# EAGLE design HRT PDB 17-18 schem (EAGLE 8.5.0)
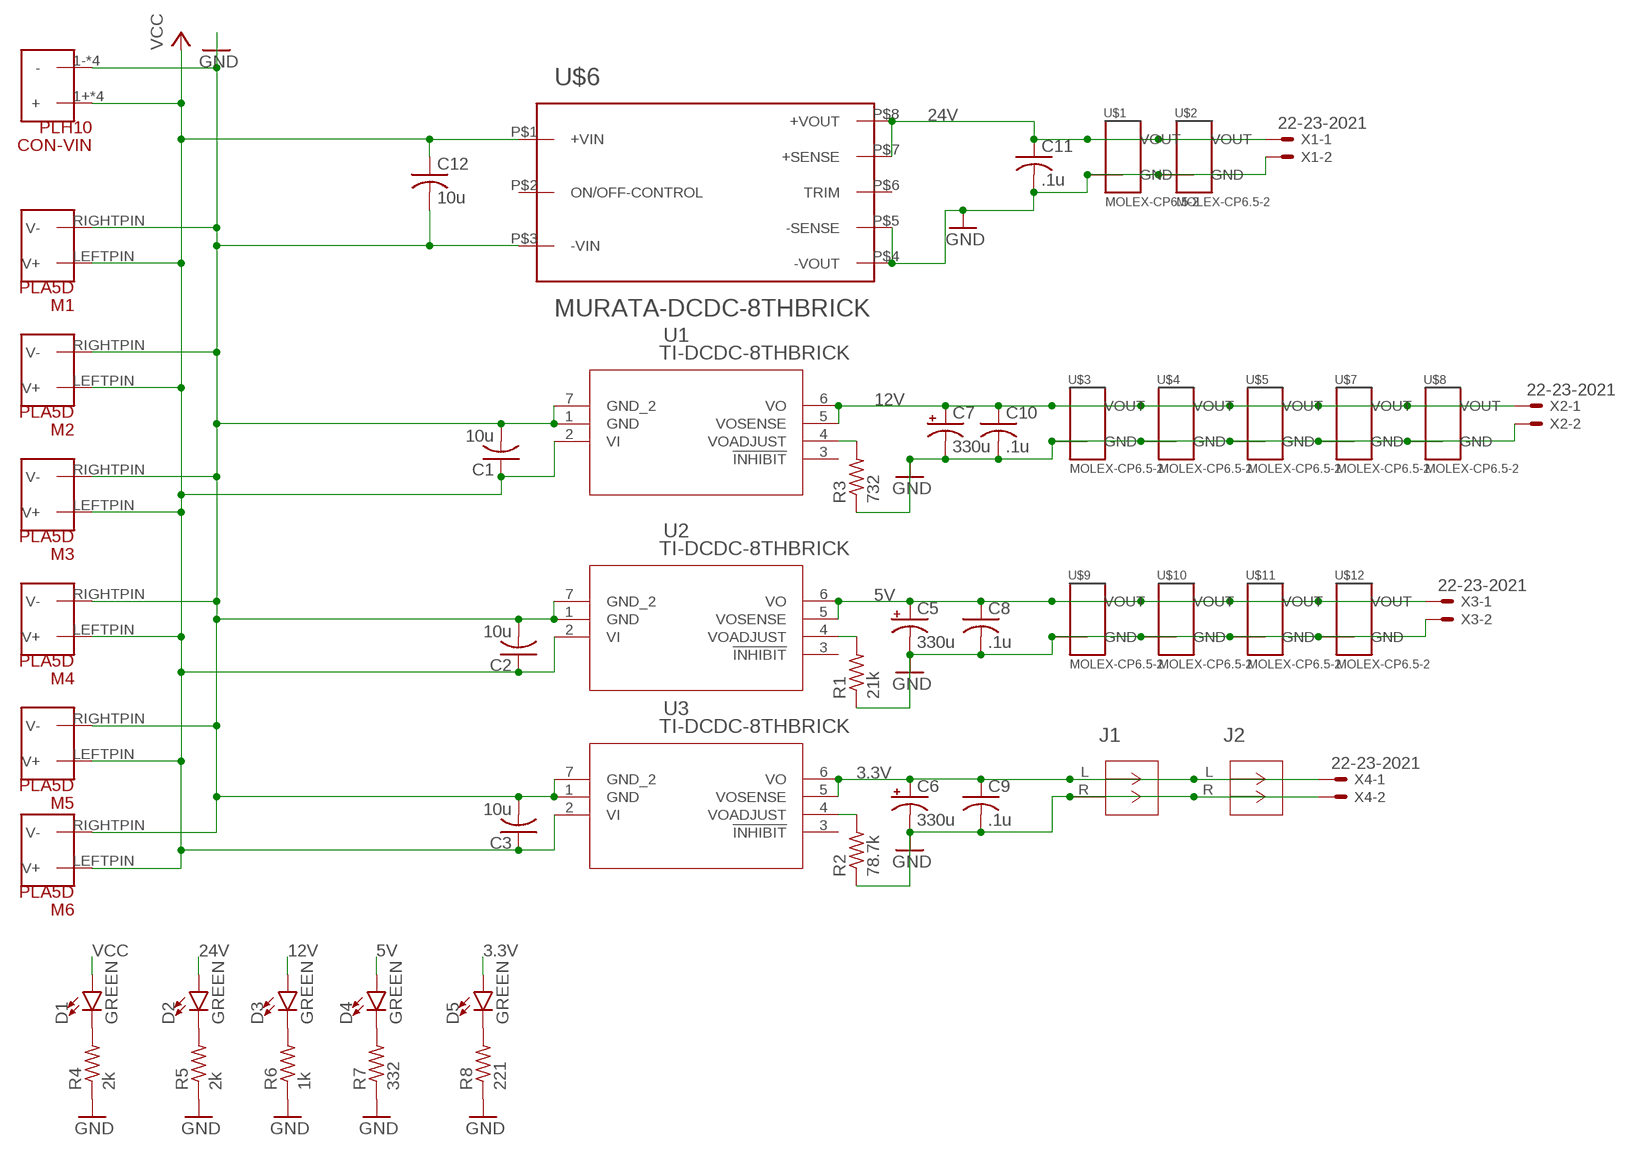
[diagram p0: schematic, sheet 1]

## Parts
C1  10u  C-USC1210  [C1210]
C2  10u  C-USC1210  [C1210]
C3  10u  C-USC1210  [C1210]
C5  330u  CPOL-USE5-10.5  [E5-10,5]
C6  330u  CPOL-USE5-10.5  [E5-10,5]
C7  330u  CPOL-USE5-10.5  [E5-10,5]
C8  .1u  C-USC0603  [C0603]
C9  .1u  C-USC0603  [C0603]
C10  .1u  C-USC0603  [C0603]
C11  .1u  C-USC0603  [C0603]
C12  10u  C-USC1210  [C1210]
CON-VIN  PLH10  [PLH10PCKG]
D1  GREEN  LED-GREEN0603  [LED-0603]
D2  GREEN  LED-GREEN0603  [LED-0603]
D3  GREEN  LED-GREEN0603  [LED-0603]
D4  GREEN  LED-GREEN0603  [LED-0603]
D5  GREEN  LED-GREEN0603  [LED-0603]
J1  TE-TERM-BLOCK  [TE-TERM-BLOCK]
J2  TE-TERM-BLOCK  [TE-TERM-BLOCK]
M1  PLA5D  [PLA5PACK]
M2  PLA5D  [PLA5PACK]
M3  PLA5D  [PLA5PACK]
M4  PLA5D  [PLA5PACK]
M5  PLA5D  [PLA5PACK]
M6  PLA5D  [PLA5PACK]
R1  21k  R-US_R0603  [R0603]
R2  78.7k  R-US_R0603  [R0603]
R3  732  R-US_R0603  [R0603]
R4  2k  R-US_R0805  [R0805]
R5  2k  R-US_R0805  [R0805]
R6  1k  R-US_R0805  [R0805]
R7  332  R-US_R0805  [R0805]
R8  221  R-US_R0805  [R0805]
U1  TI-DCDC-8THBRICK  [TIBRICK]
U2  TI-DCDC-8THBRICK  [TIBRICK]
U3  TI-DCDC-8THBRICK  [TIBRICK]
U$1  MOLEX-CP6.5-2  [151048-X2XX]
U$2  MOLEX-CP6.5-2  [151048-X2XX]
U$3  MOLEX-CP6.5-2  [151048-X2XX]
U$4  MOLEX-CP6.5-2  [151048-X2XX]
U$5  MOLEX-CP6.5-2  [151048-X2XX]
U$6  MURATA-DCDC-8THBRICK  [MURATA-8THBRICK]
U$7  MOLEX-CP6.5-2  [151048-X2XX]
U$8  MOLEX-CP6.5-2  [151048-X2XX]
U$9  MOLEX-CP6.5-2  [151048-X2XX]
U$10  MOLEX-CP6.5-2  [151048-X2XX]
U$11  MOLEX-CP6.5-2  [151048-X2XX]
U$12  MOLEX-CP6.5-2  [151048-X2XX]
X1  22-23-2021  [22-23-2021]
X2  22-23-2021  [22-23-2021]
X3  22-23-2021  [22-23-2021]
X4  22-23-2021  [22-23-2021]

## Nets
3.3V: C6.+ C9.1 D5.A J1.L J2.L U3.5(VOSENSE) U3.6(VO) X4.1
5V: C5.+ C8.1 D4.A U2.5(VOSENSE) U2.6(VO) U$9.VOUT U$10.VOUT U$11.VOUT U$12.VOUT X3.1
12V: C7.+ C10.1 D3.A U1.5(VOSENSE) U1.6(VO) U$3.VOUT U$4.VOUT U$5.VOUT U$7.VOUT U$8.VOUT X2.1
24V: C11.1 D2.A U$1.VOUT U$2.VOUT U$6.P$7(+SENSE) U$6.P$8(+VOUT) X1.1
GND: C1.2 C2.2 C3.2 C5.- C6.- C7.- C8.2 C9.2 C10.2 C11.2 C12.2 CON-VIN.1-(-) CON-VIN.2-(-) CON-VIN.3-(-) CON-VIN.4-(-) J1.R J2.R M1.RIGHTPIN(V-) M2.RIGHTPIN(V-) M3.RIGHTPIN(V-) M4.RIGHTPIN(V-) M5.RIGHTPIN(V-) M6.RIGHTPIN(V-) R1.1 R2.1 R3.1 R4.1 R5.1 R6.1 R7.1 R8.1 U1.1(GND) U1.7(GND_2) U2.1(GND) U2.7(GND_2) U3.1(GND) U3.7(GND_2) U$1.GND U$2.GND U$3.GND U$4.GND U$5.GND U$6.P$3(-VIN) U$6.P$4(-VOUT) U$6.P$5(-SENSE) U$7.GND U$8.GND U$9.GND U$10.GND U$11.GND U$12.GND X1.2 X2.2 X3.2 X4.2
N$2: D1.C R4.2
N$3: D2.C R5.2
N$4: R2.2 U3.4(VOADJUST)
N$5: R3.2 U1.4(VOADJUST)
N$6: R1.2 U2.4(VOADJUST)
N$7: D3.C R6.2
N$8: D4.C R7.2
N$9: D5.C R8.2
VCC: C1.1 C2.1 C3.1 C12.1 CON-VIN.1+(+) CON-VIN.2+(+) CON-VIN.3+(+) CON-VIN.4+(+) D1.A M1.LEFTPIN(V+) M2.LEFTPIN(V+) M3.LEFTPIN(V+) M4.LEFTPIN(V+) M5.LEFTPIN(V+) M6.LEFTPIN(V+) U1.2(VI) U2.2(VI) U3.2(VI) U$6.P$1(+VIN)
Unconnected: U1.3(!INHIBIT) U2.3(!INHIBIT) U3.3(!INHIBIT) U$6.P$2(ON/OFF-CONTROL) U$6.P$6(TRIM)

## Library data of the parts
C1-C3 C8-C12 = rcl:C-US: CAPACITOR, American symbol; SPICEPREFIX: C
C5-C7 = rcl:CPOL-US: POLARIZED CAPACITOR, American symbol; SPICEPREFIX: C
CON-VIN = HuskyRobotics17-18:PLH10: Phoenix PLH 5/ 2-7,5-ZF - 1792106 10mm spaced 51A latch terminal block 2 pos
D1-D5 = SparkFun-LED:LED-GREEN: Green SMD LED Used in manufacturing of various products at SparkFun Packages: 0603 - SMD 0603 package [Product Link] <http://www.futureelectronics.com/en/technologies/semiconductors/optoelectronics/leds/Pages/9894312-LTST-C190GKT.aspx?CrossPart=HSMG-C190&IM=0> LilyPad 1206 - SMD1206 LilyPad package [Product Link] <http://www.futureelectronics.com/en/Technologies/Product.aspx?ProductID=IN150NGHARVATEKCORPORATION2049943&IM=0> 1206 - SMD1206 package [Product Link] <http://www.futureelectronics.com/en/technologies/semiconductors/optoelectronics/leds/Pages/8315665-LTST-C150KGKT.aspx?IM=0> 1206 Bottom Mount -SMD 1206 Bottom Mount [Product Link] <http://www.digikey.com/product-detail/en/lite-on-inc/LTST-C230KGKT/160-1456-1-ND/386854> SparkFun Products: Pro Mini 328 -5V <https://www.sparkfun.com/products/821> RedBoard <https://www.sparkfun.com/products/12757> MP3 Trigger <https://www.sparkfun.com/products/13720> Makey Makey <https://www.sparkfun.com/products/11076>; PROD_ID: DIO-00821
J1 J2 = HuskyRobotics17-18:TE-TERM-BLOCK; MANUFACTURER_PART_NUMBER: 2828342; VENDOR: Tyco Electronics
M1-M6 = HuskyRobotics17-18:PLA5D
R1-R8 = rcl:R-US_: RESISTOR, American symbol; SPICEPREFIX: R
U1-U3 = HuskyRobotics17-18:TI-DCDC-8THBRICK; MANUFACTURER_PART_NUMBER: PTN78020WAH; VENDOR: Texas Instruments
U$1-U$5 U$7-U$12 = HuskyRobotics17-18:MOLEX-CP6.5-2: 151048 Molex CP-6.5 connector. 2 circuits, thru hole. For HRC power conversion board. http://www.molex.com/molex/products/datasheet.jsp?part=active/1510481200_PCB_HEADERS.xml#documentsAnchor Alex Hoffman
U$6 = HuskyRobotics17-18:MURATA-DCDC-8THBRICK: Isolated Module DC DC Converter 1 Output 12V 6A 9V - 36V Input 811-2225-5-ND
X1-X4 = con-molex:22-23-2021: .100" (2.54mm) Center Header - 2 Pin; MF: MOLEX; MPN: 22-23-2021; OC_FARNELL: 1462926; OC_NEWARK: 25C3832

## Board
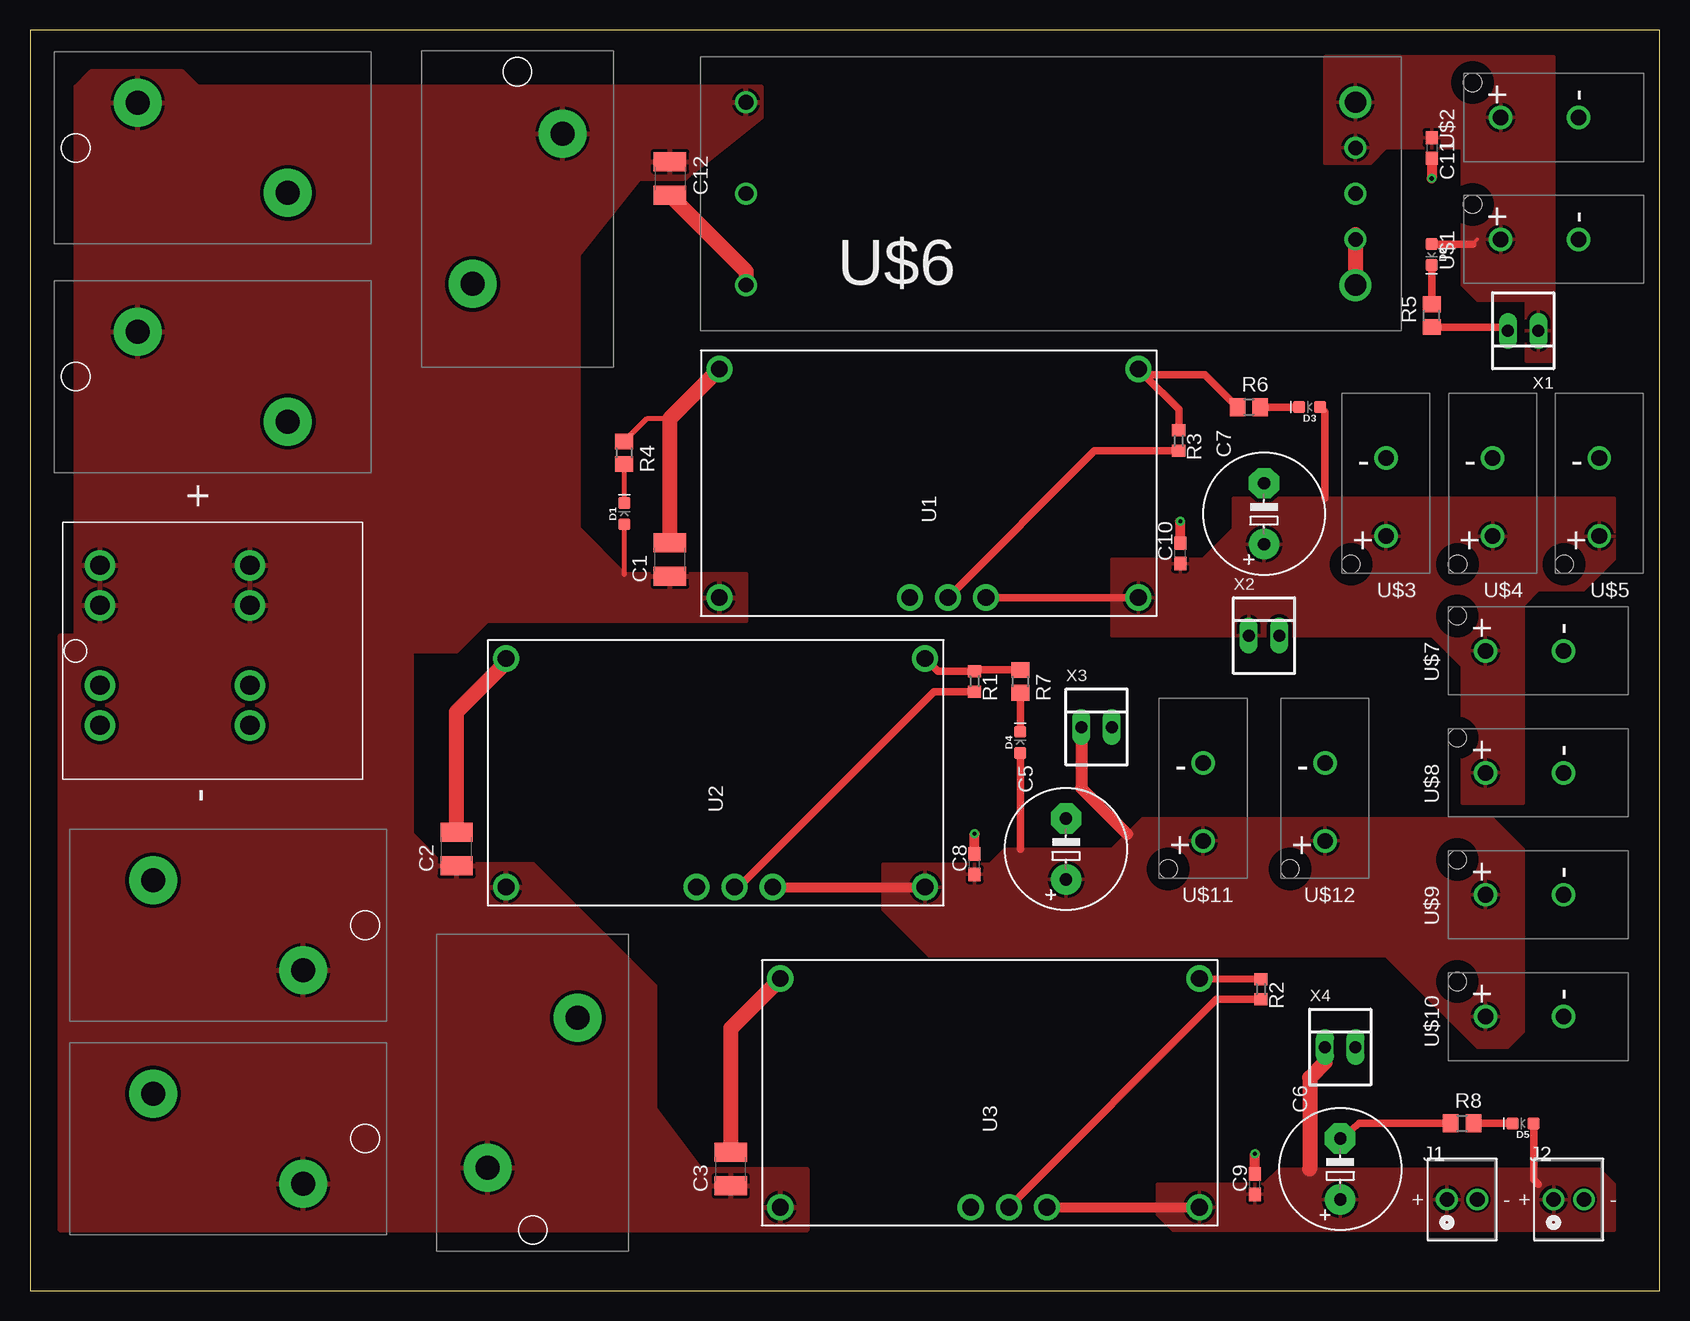
[diagram p1: board, top side]
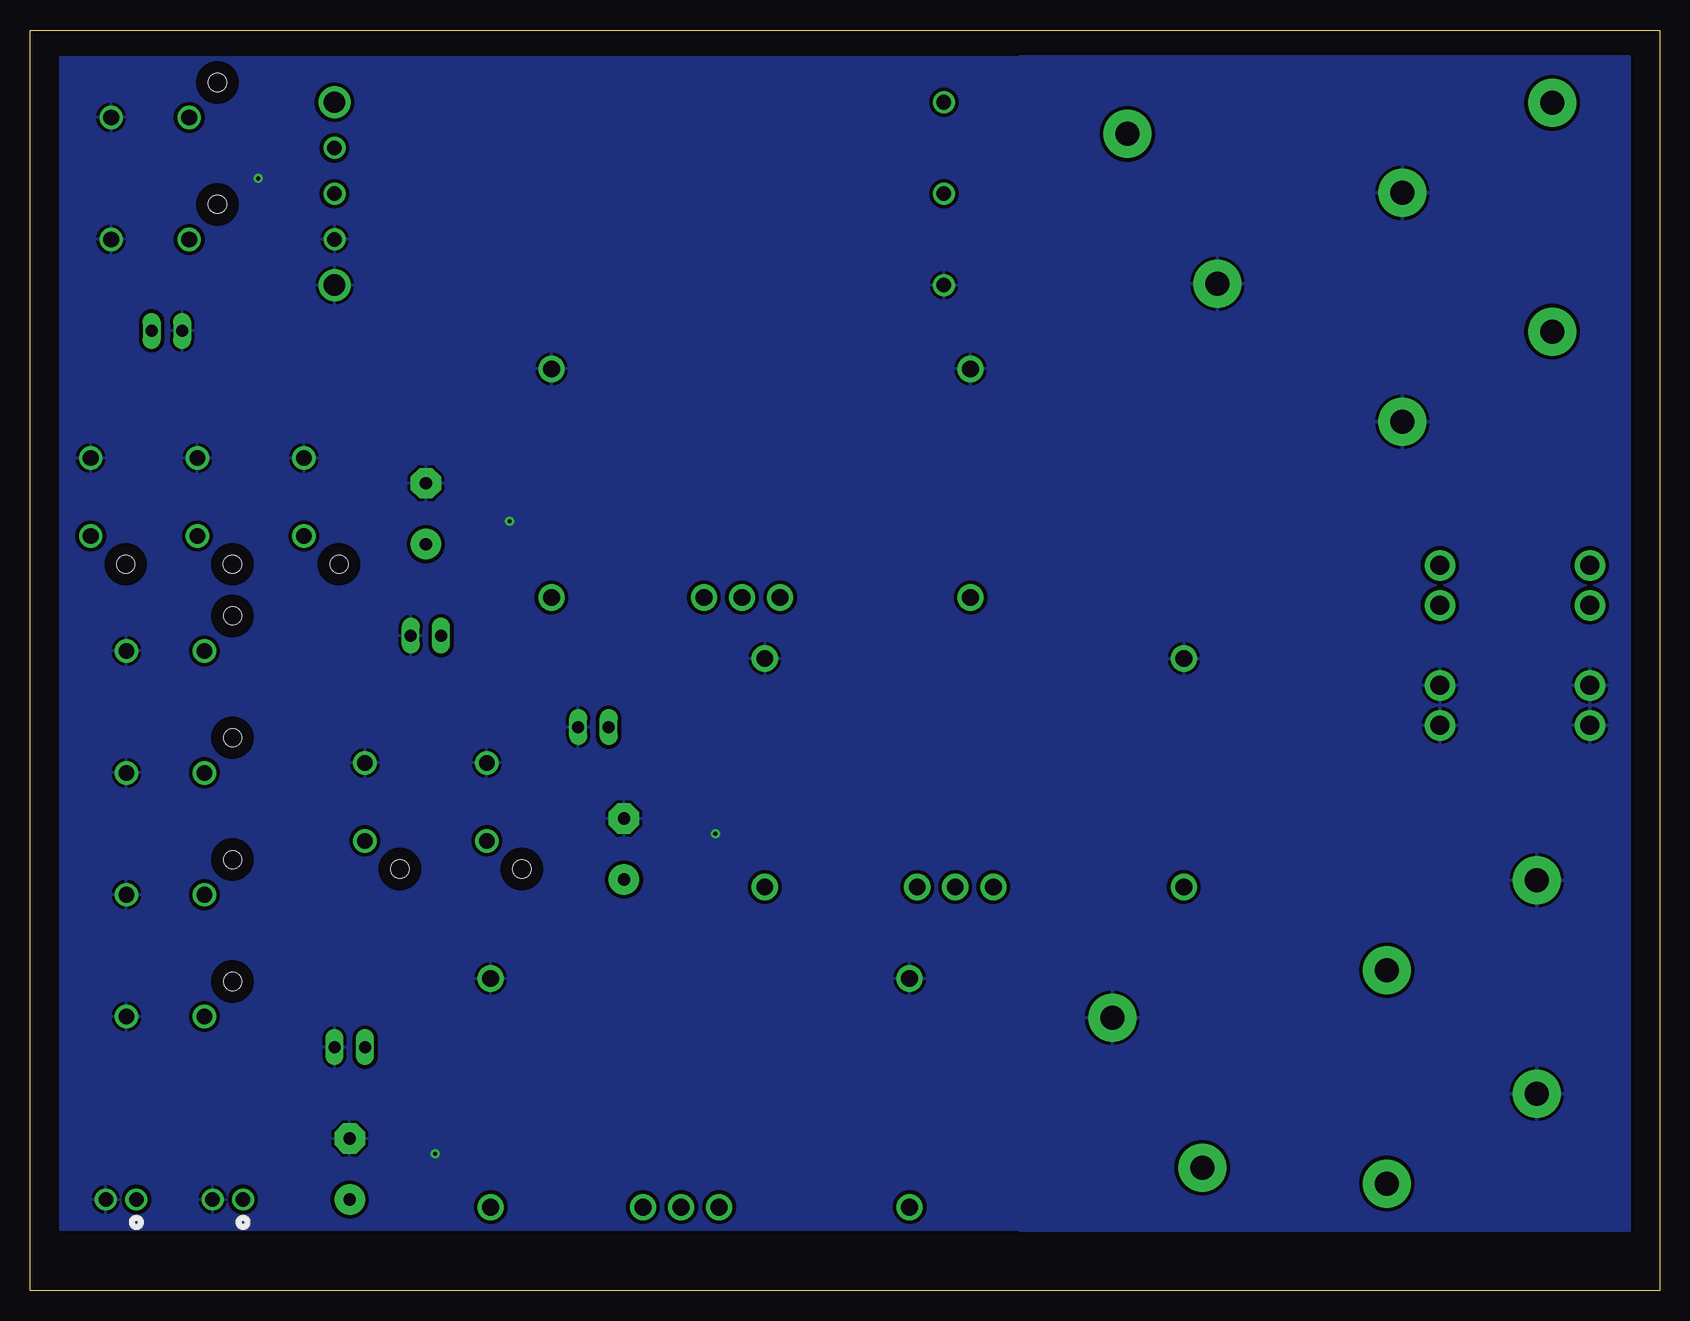
[diagram p2: board, bottom side, seen from below]

Size 135.87 x 105.08 mm. Coordinates in mm from the lower left corner, seen from the top.
Outline: 0,0 135.87,0 135.87,105.08 0,105.08 0,0
Copper layers (1*16): Top 0.035mm / dielectric 1.5mm / Bottom 0.035mm
Design rules "default": minimum track width 6mil, minimum drill 0.35mm, track to track 6mil, track to pad 6mil, pad to pad 6mil, via to via 6mil, smd to smd 6mil, copper to edge 40mil, drill to drill 6mil, minimum pad ring 10mil, minimum via ring 8mil, stop-mask expansion 4mil, vias tented up to drill 0mil, thermal gap 10mil

### Footprints (pad centres in the part's own frame; a part is rotated, then mirrored left to right if it is on the bottom)
C1210 = smd 1.6 x 2.7: 1 -1.4,0; 2 1.4,0
E5-10,5 = drill 1.016 pad 2.54: + -2.54,0 | drill 1.016 pad 2.54 octagon: - 2.54,0
C0603 = smd 1.1 x 1: 1 -0.85,0; 2 0.85,0
PLH10PCKG = drill 1.6 pad 2.54: 1+ -7.13,3.1; 1- 2.87,3.1; 2+ -3.8,3.1; 2- 6.2,3.1; 3+ -7.13,-9.4; 3- 2.87,-9.4; 4+ -3.8,-9.4; 4- 6.2,-9.4
LED-0603 = smd 1 x 1: A -0.877,0; C 0.877,0
TE-TERM-BLOCK = drill 1.219 pad 1.727: L -2.54,0; R 0,0
PLA5PACK = drill 2 pad 4: LEFTPIN -3.75,-6.25; RIGHTPIN 3.75,6.25
R0603 = smd 1 x 1.1: 1 -0.85,0; 2 0.85,0
R0805 = smd 1.3 x 1.5: 1 -0.95,0; 2 0.95,0
TIBRICK = drill 1.397 pad 2.184: 1 9.525,17.462; 2 -9.525,17.462; 3 -9.525,1.587; 4 -9.525,-1.587; 5 -9.525,-4.763; 6 -9.525,-17.462; 7 9.525,-17.462
151048-X2XX = drill 1.3: GND 0,-2.1; VOUT 0,4.4 | hole 1.5: 2.92,6.75
MURATA-8THBRICK = drill 1.219 pad 1.727: P$1 -25.4,7.62; P$2 -25.4,0; P$3 -25.4,-7.62; P$5 25.4,-3.81; P$6 25.4,0; P$7 25.4,3.81 | drill 1.778 pad 2.286: P$4 25.4,-7.62; P$8 25.4,7.62
22-23-2021 = drill 1 long: 1 -1.27,0; 2 1.27,0

### Placement (x,y rotation side)
C1  53.34,60.96 90 top
C2  35.56,36.83 90 top
C3  58.42,10.16 90 top
C5  86.36,36.83 90 top
C6  109.22,10.16 90 top
C7  102.87,64.77 90 top
C8  78.74,35.56 90 top
C9  102.11,8.89 90 top
C10  95.89,61.47 90 top
C11  116.84,95.25 270 top
C12  53.34,92.71 270 top
CON-VIN  15.24,53.34 270 top
D1  49.53,64.77 90 top
D2  116.84,86.36 270 top
D3  106.68,73.66 180 top
D4  82.55,45.72 90 top
D5  124.46,13.97 180 top
J1  120.65,7.62 0 top
J2  129.54,7.62 0 top
M1  16.51,12.7 90 top
M2  41.91,16.51 0 top
M3  15.24,95.25 270 top
M4  16.51,30.48 90 top
M5  15.24,76.2 270 top
M6  40.64,90.17 180 top
R1  78.74,50.8 270 top
R2  102.62,25.15 270 top
R3  95.76,70.87 270 top
R4  49.53,69.85 270 top
R5  116.84,81.28 90 top
R6  101.6,73.66 0 top
R7  82.55,50.8 270 top
R8  119.38,13.97 0 top
U1  74.93,67.31 90 top
U2  57.15,43.18 90 top
U3  80.01,16.51 90 top
U$1  127,87.63 90 top
U$2  127,97.79 90 top
U$3  113.03,67.31 180 top
U$4  121.92,67.31 180 top
U$5  130.81,67.31 180 top
U$6  85.09,91.44 0 top
U$7  125.73,53.34 90 top
U$8  125.73,43.18 90 top
U$9  125.73,33.02 90 top
U$10  125.73,22.86 90 top
U$11  97.79,41.91 180 top
U$12  107.95,41.91 180 top
X1  124.46,80.01 180 top
X2  102.87,54.61 0 top
X3  88.9,46.99 0 top
X4  109.22,20.32 0 top

### Tracks (layer width: path | path; a pad name or v marks a point on that pad's centre or on a via)
3.3V
  Top 0.61: D5.A 125.34,9.28 125.73,8.89
  Top 0.813: U3.5 U3.6
  Top 1.27: X4.1 107.95,19.05 106.68,17.78 106.68,10.16
  pour Top: 93.98,8.89 93.98,6.35 95.25,5.08 132.08,5.08 132.08,8.89 130.81,10.16 105.41,10.16 104.14,10.16 102.87,8.89
5V
  Top 0.61: D4.A 82.55,36.83
  Top 0.813: U2.5 U2.6
  Top 1.016: 91.44,38.1 87.63,41.91 X3.1
  pour Top: 71.12,35.56 71.12,31.75 72.39,30.48 74.93,27.94 113.03,27.94 120.65,20.32 123.19,20.32 124.46,21.59 124.46,36.83 121.92,39.37 93.98,39.37 92.71,39.37 90.17,36.83 82.55,36.83 81.28,36.83 80.01,35.56
12V
  Top 0.61: U1.5 U1.6 | D3.A 107.95,73.27 107.95,66.04
  pour Top (isolate 0.305): 90.17,60.96 90.17,54.61 116.84,54.61 119.38,52.07 119.38,40.64 124.46,40.64 124.46,57.15 125.73,58.42 129.54,58.42 132.08,60.96 132.08,66.04 100.33,66.04 100.33,63.5 97.79,60.96
24V
  Top 0.305: 120.26,87.24 120.65,87.63
  Top 0.61: D2.A 120.26,87.24
  pour Top: 107.95,102.87 107.95,93.98 111.76,93.98 113.03,95.25 119.38,95.25 119.38,83.82 120.65,82.55 124.71,82.55 124.71,77.47 127,77.47 127,102.87
GND  (via drill 0.35)
  Top 0.305: 122.87,80.33 X1.2
  Top 0.406: R4.1 51.44,72.71 53.34,72.71
  Top 0.61: R5.1 122.87,80.33 | R3.1 95.76,73.47 92.87,76.36 | 92.87,76.36 U1.7 | R6.1 97.95,76.36 92.87,76.36 | R7.1 78.84,51.75 R1.1 75.67,51.65 U2.7 | R2.1 98,26.04 U3.7 | R8.1 110.81,13.97 C6.-
  Top 0.813: C10.2 v95.89,64.14 | C11.2 v116.84,92.71 | C8.2 v78.74,38.1 | C9.2 v102.11,11.43
  Top 1.27: C2.2 35.56,48.26 39.69,52.39 U2.1 | C3.2 58.42,21.91 U3.1 | C1.2 53.34,72.71 U1.1 | C12.2 59.69,84.96 U$6.P$3 | 110.49,88.05 U$6.P$4
  pour Bottom (isolate 0.305): 2.54,102.87 2.54,5.08 53.34,5.08 53.34,102.87
  pour Bottom (isolate 0.305): 50.8,102.87 52.07,5.08 133.35,5.08 133.35,102.87
N$2
  Top 0.406: R4.2 D1.C
N$3
  Top 0.61: D2.C R5.2
N$4
  Top 0.61: U3.4 98.91,24.3 R2.2
N$5
  Top 0.61: U1.4 88.75,70.02 R3.2
N$6
  Top 0.61: R1.2 75.35,49.95 59.05,33.66 U2.4
N$7
  Top 0.61: D3.C R6.2
N$8
  Top 0.61: D4.C R7.2
N$9
  Top 0.61: D5.C R8.2
VCC
  Top 0.406: D1.A 49.53,59.69
  pour Top (isolate 0.305): 3.81,53.34 35.56,53.34 38.1,55.88 59.69,55.88 59.69,59.69 49.53,59.69 45.72,63.5 45.72,86.36 50.8,92.71 54.61,92.71 60.96,97.79 60.96,100.33 13.97,100.33 12.7,101.6 5.08,101.6 3.81,100.33
  pour Top (isolate 0.305): 31.75,54.61 31.75,38.1 34.29,35.56 41.91,35.56 52.07,25.4 52.07,15.24 55.88,10.16 64.77,10.16 64.77,5.08 2.54,5.08 2.54,54.61